# Altium schematic sheet 4.7uF 25V SCH.schdoc
size 124 x 101 mm
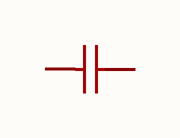
[diagram p0: 4.7uF 25V SCH.schdoc]

## Parts
C?  4.7uF  [C0603]  (value not drawn)

## Nets

Not connected (* = marked no-connect by the designer): C? 1 2

## Library data of the parts
C? = CL10A475KA8NQNC: Manufacturer: SAMSUNG(三星); Add into BOM: yes; Tolerance: ±10%; Symbol: CL10A475KA8NQNC; Device: CL10A475KA8NQNC; LCSC Part Name: 4.7uF ±10% 25V; Supplier Part: C69335; Manufacturer Part: CL10A475KA8NQNC; Supplier Footprint: 0603; JLCPCB Part Class: Extended Part; Datasheet: https://atta.szlcsc.com/upload/public/pdf/source/20161108/1478586410580.pdf; Supplier: LCSC; Convert to PCB: yes; Value: 4.7uF